# EAGLE schematic ToastSchematic (EAGLE 9.2.1)

## Sheet 1 of 2
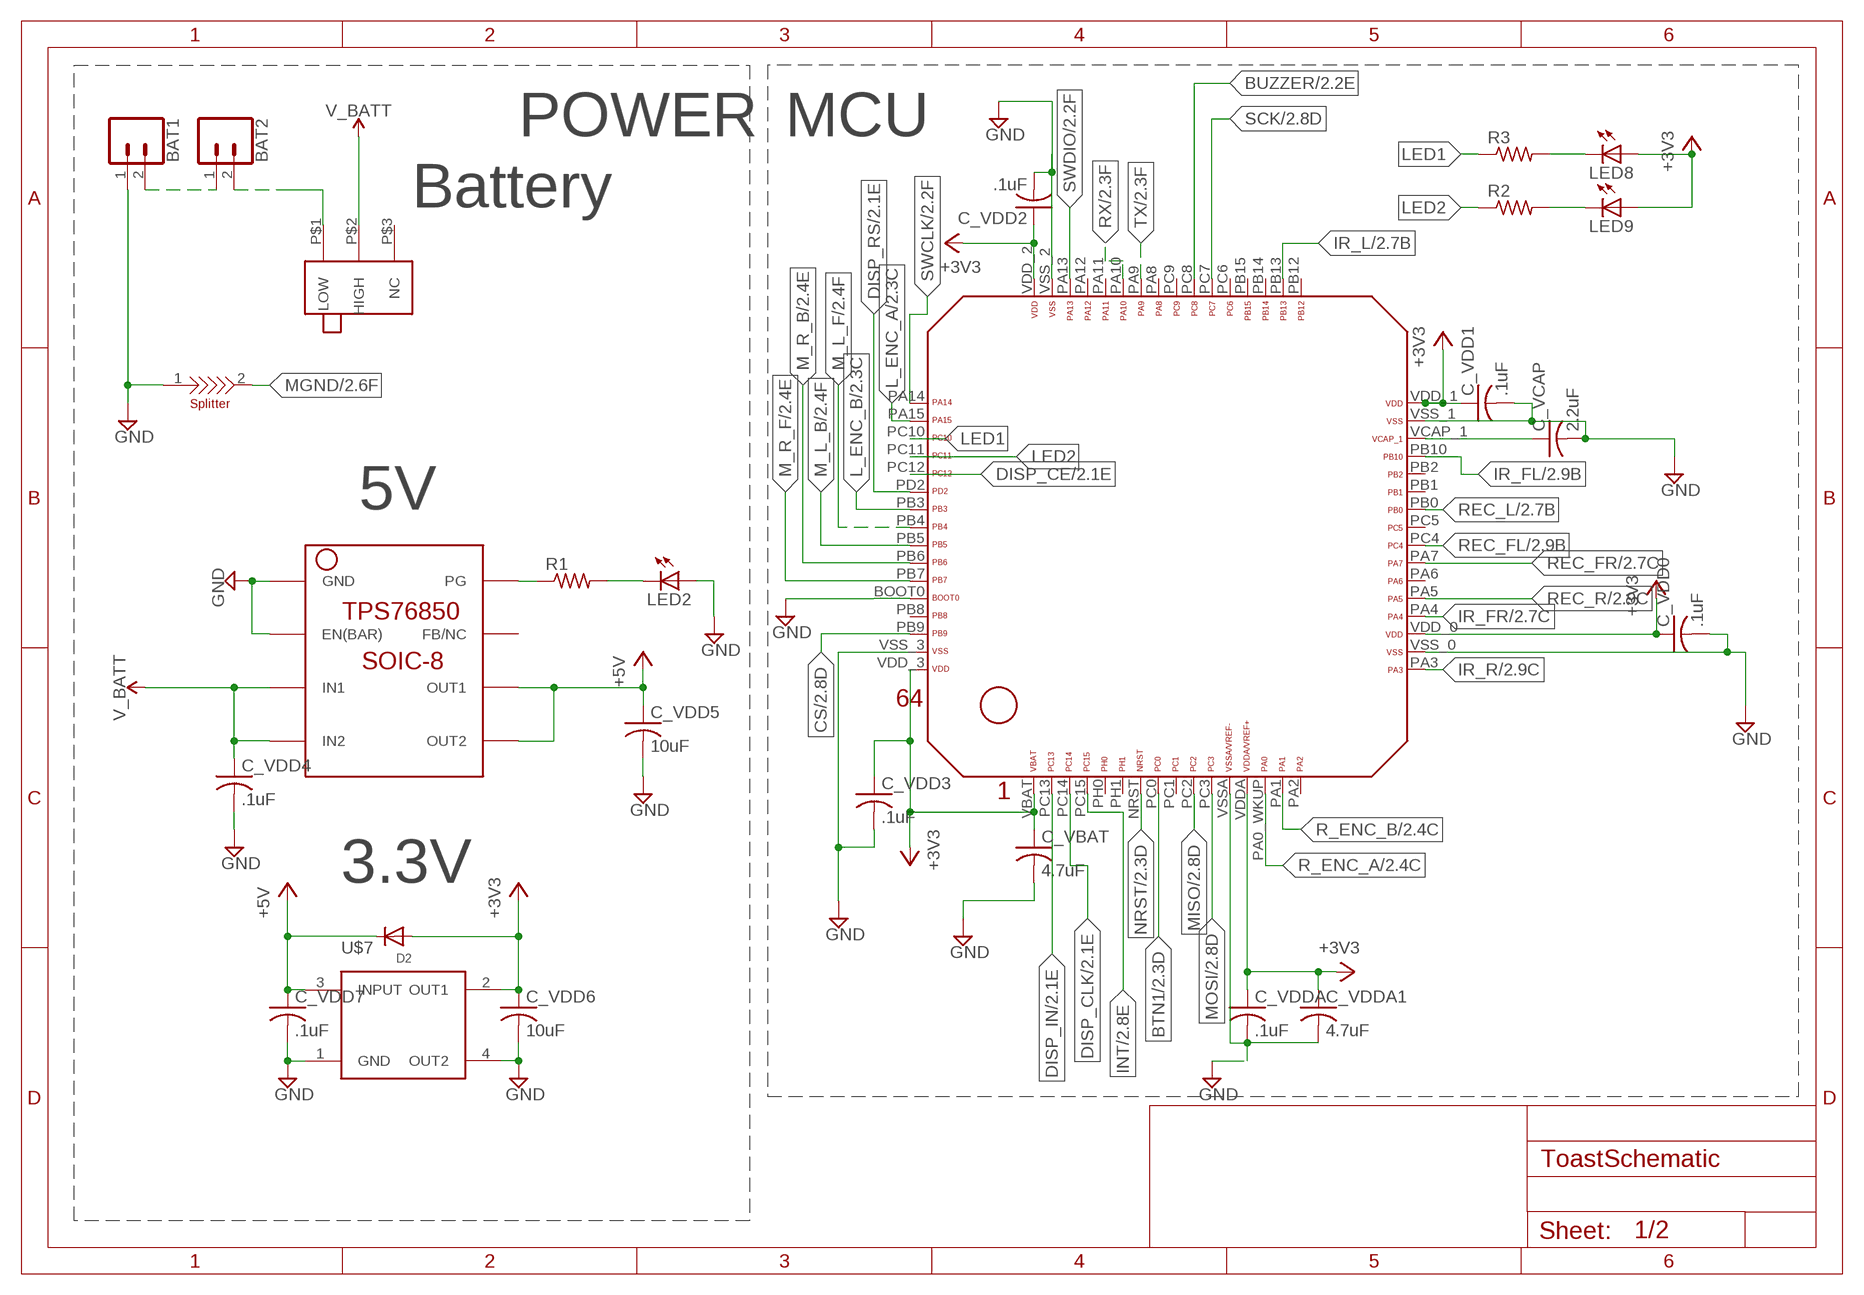
[diagram p0: schematic, sheet 1]

### Parts
BAT1  CONN_02JST-PTH-2  [JST-2-PTH]
BAT2  CONN_02JST-PTH-2  [JST-2-PTH]
C_VBAT  4.7uF  C-USC0603  [C0603]
C_VCAP  2.2uF  C-USC0603  [C0603]
C_VDD0  .1uF  C-USC0603  [C0603]
C_VDD1  .1uF  C-USC0603  [C0603]
C_VDD2  .1uF  C-USC0603  [C0603]
C_VDD3  .1uF  C-USC0603  [C0603]
C_VDD4  .1uF  C-USC0603  [C0603]
C_VDD5  10uF  C-USC0603  [C0603]
C_VDD6  10uF  C-USC0603  [C0603]
C_VDD7  .1uF  C-USC0603  [C0603]
C_VDDA  .1uF  C-USC0603  [C0603]
C_VDDA1  4.7uF  C-USC0603  [C0603]
D2  DIODESOD-323F  [SOD-323F]
LED2  LEDCHIPLED_0603  [CHIPLED_0603]
LED8  LEDCHIPLED_0603  [CHIPLED_0603]
LED9  LEDCHIPLED_0603  [CHIPLED_0603]
R1  R-US_R0603  [R0603]
R2  R-US_R0603  [R0603]
R3  R-US_R0603  [R0603]
U$1  STM32F411/446_LQFP64  [STM32F411/446_LQFP64]
U$2  GH39P0  [GH39P0]
U$3  TPS76850(SOIC-8)  [TPS76850(SOIC-8)]
U$7  TLV1117  [SOT-223]
U$9  SPLITTER  [SPLITTER]

### Nets
+3V3: C_VBAT.1 C_VDD0.1 C_VDD1.1 C_VDD2.1 C_VDD3.1 C_VDD6.1 C_VDDA1.1 C_VDDA.1 D2.A LED8.A LED9.A U$1.VBAT U$1.VDD_0 U$1.VDD_1 U$1.VDD_2 U$1.VDD_3 U$1.VDDA U$7.2(OUT1) ; also sheet 2
+5V: C_VDD5.1 C_VDD7.1 D2.C U$3.OUT1 U$3.OUT2 U$7.3(INPUT) ; also sheet 2
BTN1: U$1.PC0 ; also sheet 2
BUZZER: U$1.PC8 ; also sheet 2
CS: U$1.PB9 ; also sheet 2
DISP_CE: U$1.PC12 ; also sheet 2
DISP_CLK: U$1.PC14 ; also sheet 2
DISP_IN: U$1.PC13 ; also sheet 2
DISP_RS: U$1.PD2 ; also sheet 2
GND: BAT1.1 C_VBAT.2 C_VCAP.2 C_VDD0.2 C_VDD1.2 C_VDD2.2 C_VDD3.2 C_VDD4.2 C_VDD5.2 C_VDD6.2 C_VDD7.2 C_VDDA1.2 C_VDDA.2 LED2.A U$1.BOOT0 U$1.VSS_0 U$1.VSS_1 U$1.VSS_2 U$1.VSS_3 U$1.VSSA U$3.EN(BAR) U$3.GND U$7.1(GND) U$7.4(OUT2) U$9.1 ; also sheet 2
INT: U$1.PC15 ; also sheet 2
IR_FL: U$1.PB10 ; also sheet 2
IR_FR: U$1.PA4 ; also sheet 2
IR_L: U$1.PB13 ; also sheet 2
IR_R: U$1.PA3 ; also sheet 2
L_ENC_A: U$1.PA15 ; also sheet 2
L_ENC_B: U$1.PB3 ; also sheet 2
LED1: R3.1 U$1.PC10
LED2: R2.1 U$1.PC11
M_L_B: U$1.PB5 ; also sheet 2
M_L_F: U$1.PB4 ; also sheet 2
M_R_B: U$1.PB6 ; also sheet 2
M_R_F: U$1.PB7 ; also sheet 2
MGND: U$9.2 ; also sheet 2
MISO: U$1.PC2 ; also sheet 2
MOSI: U$1.PC3 ; also sheet 2
N$1: BAT1.2 BAT2.1
N$2: BAT2.2 U$2.P$1(LOW)
N$5: C_VCAP.1 U$1.VCAP_1
N$6: LED8.C R3.2
N$11: LED2.C R1.2
N$22: R1.1 U$3.PG
N$25: LED9.C R2.2
NRST: U$1.NRST ; also sheet 2
R_ENC_A: U$1.PA0_WKUP(PA0_AKUP) ; also sheet 2
R_ENC_B: U$1.PA1 ; also sheet 2
REC_FL: U$1.PC4 ; also sheet 2
REC_FR: U$1.PA7 ; also sheet 2
REC_L: U$1.PB0 ; also sheet 2
REC_R: U$1.PA5 ; also sheet 2
RX: U$1.PA10 ; also sheet 2
SCK: U$1.PC7 ; also sheet 2
SWCLK: U$1.PA14 ; also sheet 2
SWDIO: U$1.PA13 ; also sheet 2
TX: U$1.PA9 ; also sheet 2
V_BATT: C_VDD4.1 U$2.P$2(HIGH) U$3.IN1 U$3.IN2 ; also sheet 2
Unconnected: U$1.PA2 U$1.PA6 U$1.PA8 U$1.PA11 U$1.PA12 U$1.PB1 U$1.PB2 U$1.PB8 U$1.PB12 U$1.PB14 U$1.PB15 U$1.PC1 U$1.PC5 U$1.PC6 U$1.PC9 U$1.PH0 U$1.PH1 U$2.P$3(NC) U$3.FB/NC

### Notes on the sheet
- POWER | MCU
- Battery
- 5V
- 3.3V

## Sheet 2 of 2
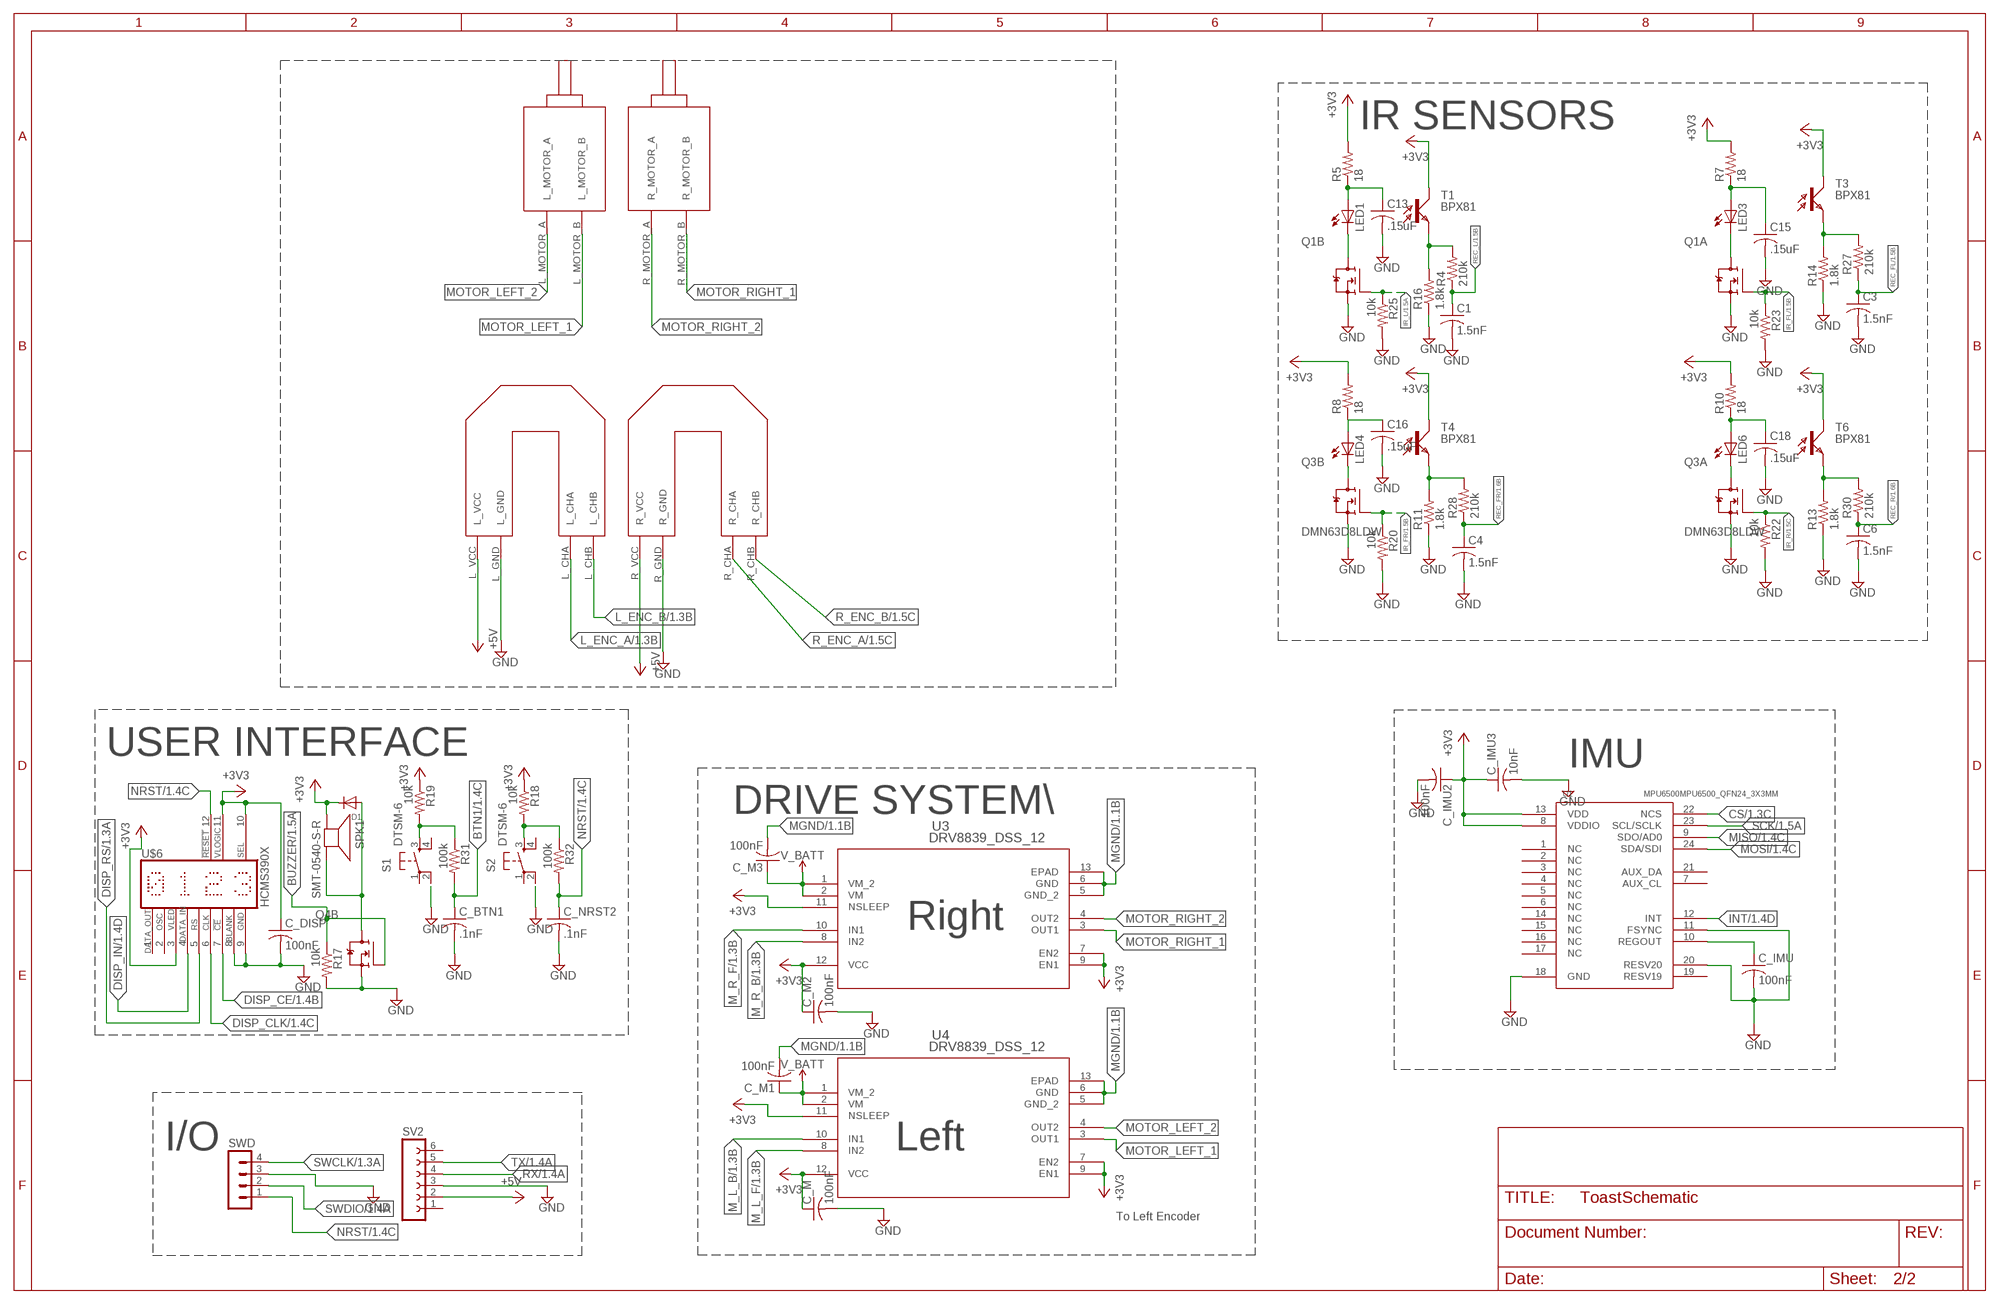
[diagram p1: schematic, sheet 2]

### Parts
C1  1.5nF  C-USC0603K  [C0603K]
C3  1.5nF  C-USC0603K  [C0603K]
C4  1.5nF  C-USC0603K  [C0603K]
C6  1.5nF  C-USC0603K  [C0603K]
C13  .15uF  C-USC0603K  [C0603K]
C15  .15uF  C-USC0603K  [C0603K]
C16  .15uF  C-USC0603K  [C0603K]
C18  .15uF  C-USC0603K  [C0603K]
C_BTN1  .1nF  C-USC0603K  [C0603K]
C_DISP  100nF  C-USC0603K  [C0603K]
C_IMU  100nF  C-USC0603K  [C0603K]
C_IMU2  100nF  C-USC0603K  [C0603K]
C_IMU3  10nF  C-USC0603K  [C0603K]
C_M  100nF  C-USC0603K  [C0603K]
C_M1  100nF  C-USC0603K  [C0603K]
C_M2  100nF  C-USC0603K  [C0603K]
C_M3  100nF  C-USC0603K  [C0603K]
C_NRST2  .1nF  C-USC0603K  [C0603K]
D1  DIODESOD-323F  [SOD-323F]
LED1  LED5MM  [LED5MM]
LED3  LED5MM  [LED5MM]
LED4  LED5MM  [LED5MM]
LED6  LED5MM  [LED5MM]
Q1  DMN63D8LDW  [SOT363]
Q3  DMN63D8LDW  [SOT363]
Q4  DMN63D8LDW  [SOT363]
R4  210k  R-US_R0603  [R0603]
R5  18  R-US_R0603  [R0603]
R7  18  R-US_R0603  [R0603]
R8  18  R-US_R0603  [R0603]
R10  18  R-US_R0603  [R0603]
R11  1.8k  R-US_R0603  [R0603]
R13  1.8k  R-US_R0603  [R0603]
R14  1.8k  R-US_R0603  [R0603]
R16  1.8k  R-US_R0603  [R0603]
R17  10k  R-US_R0603  [R0603]
R18  10k  R-US_R0603  [R0603]
R19  10k  R-US_R0603  [R0603]
R20  10k  R-US_R0603  [R0603]
R22  10k  R-US_R0603  [R0603]
R23  10k  R-US_R0603  [R0603]
R25  10k  R-US_R0603  [R0603]
R27  210k  R-US_R0603  [R0603]
R28  210k  R-US_R0603  [R0603]
R30  210k  R-US_R0603  [R0603]
R31  100k  R-US_R0603  [R0603]
R32  100k  R-US_R0603  [R0603]
S1  DTSM-6  [DTSM-6]
S2  DTSM-6  [DTSM-6]
SPK1  SMT-0540-S-R  [SMT-0540-S-R]
SV2  FE06-1  [FE06]
SWD  MA04-1  [MA04-1]
T1  BPX81  [BPX81]
T3  BPX81  [BPX81]
T4  BPX81  [BPX81]
T6  BPX81  [BPX81]
U1  MPU6500MPU6500_QFN24_3X3MM  [QFN24_3X3MM]
U3  DRV8839_DSS_12  [DSS12_P9X2]
U4  DRV8839_DSS_12  [DSS12_P9X2]
U$4  FUTURA_V1.0_MOTOR_MOUNT  [FUTURA_V1.0_MOTOT_MOUNT]
U$6  HCMS390X  [HCMS390X]

### Nets
+3V3: C_DISP.1 C_IMU2.1 C_IMU3.1 C_M2.1 C_M.1 D1.C R5.2 R7.2 R8.2 R10.2 R18.1 R19.1 SPK1.-(+) T1.C T3.C T4.C T6.C U1.8(VDDIO) U1.13(VDD) U3.7(EN2) U3.9(EN1) U3.11(NSLEEP) U3.12(VCC) U4.7(EN2) U4.9(EN1) U4.11(NSLEEP) U4.12(VCC) U$6.3(VLED) U$6.10(SEL) U$6.11(VLOGIC) ; also sheet 1
+5V: SV2.2 U$4.L_VCC U$4.R_VCC ; also sheet 1
BTN1: C_BTN1.1 R31.2 ; also sheet 1
BUZZER: Q4.5(B:G) R17.1 ; also sheet 1
CS: U1.22(NCS) ; also sheet 1
DISP_CE: U$6.7(!CE) ; also sheet 1
DISP_CLK: U$6.6(CLK) ; also sheet 1
DISP_IN: U$6.4(IN) ; also sheet 1
DISP_RS: U$6.5(RS) ; also sheet 1
GND: C1.2 C3.2 C4.2 C6.2 C13.2 C15.2 C16.2 C18.2 C_BTN1.2 C_DISP.2 C_IMU2.2 C_IMU3.2 C_IMU.2 C_M2.2 C_M.2 C_NRST2.2 Q1.1(A:S) Q1.4(B:S) Q3.1(A:S) Q3.4(B:S) Q4.4(B:S) R11.1 R13.1 R14.1 R16.1 R17.2 R20.2 R22.2 R23.2 R25.2 S1.2 S2.2 SV2.3 SWD.3 U1.11(FSYNC) U1.18(GND) U1.20(RESV20) U$4.L_GND U$4.R_GND U$6.8(BLANK) U$6.9(GND) ; also sheet 1
INT: U1.12(INT) ; also sheet 1
IR_FL: Q1.2(A:G) R23.1 ; also sheet 1
IR_FR: Q3.5(B:G) R20.1 ; also sheet 1
IR_L: Q1.5(B:G) R25.1 ; also sheet 1
IR_R: Q3.2(A:G) R22.1 ; also sheet 1
L_ENC_A: U$4.L_CHA ; also sheet 1
L_ENC_B: U$4.L_CHB ; also sheet 1
M_L_B: U4.10(IN1) ; also sheet 1
M_L_F: U4.8(IN2) ; also sheet 1
M_R_B: U3.8(IN2) ; also sheet 1
M_R_F: U3.10(IN1) ; also sheet 1
MGND: C_M1.2 C_M3.2 U3.5(GND_2) U3.6(GND) U3.13(EPAD) U4.5(GND_2) U4.6(GND) U4.13(EPAD) ; also sheet 1
MISO: U1.9(SDO/AD0) ; also sheet 1
MOSI: U1.24(SDA/SDI) ; also sheet 1
MOTOR_LEFT_1: U4.3(OUT1) U$4.L_MOTOR_B
MOTOR_LEFT_2: U4.4(OUT2) U$4.L_MOTOR_A
MOTOR_RIGHT_1: U3.3(OUT1) U$4.R_MOTOR_B
MOTOR_RIGHT_2: U3.4(OUT2) U$4.R_MOTOR_A
N$8: C13.1 LED1.A R5.1
N$9: LED1.K(C) Q1.3(B:D)
N$10: R19.2 R31.1 S1.3
N$12: LED3.K(C) Q1.6(A:D)
N$13: R18.2 R32.1 S2.3
N$14: C18.1 LED6.A R10.1
N$15: LED6.K(C) Q3.6(A:D)
N$16: C16.1 LED4.A R8.1
N$17: C_IMU.1 U1.10(REGOUT)
N$18: LED4.K(C) Q3.3(B:D)
N$23: D1.A Q4.3(B:D) SPK1.+(-)
N$24: R4.2 R16.2 T1.E
N$27: R14.2 R27.2 T3.E
N$28: R11.2 R28.2 T4.E
N$32: R13.2 R30.2 T6.E
N$33: C15.1 LED3.A R7.1
NRST: C_NRST2.1 R32.2 SWD.1 U$6.12(NOT_RESET) ; also sheet 1
R_ENC_A: U$4.R_CHA ; also sheet 1
R_ENC_B: U$4.R_CHB ; also sheet 1
REC_FL: C3.1 R27.1 ; also sheet 1
REC_FR: C4.1 R28.1 ; also sheet 1
REC_L: C1.1 R4.1 ; also sheet 1
REC_R: C6.1 R30.1 ; also sheet 1
RX: SV2.4 ; also sheet 1
SCK: U1.23(SCL/SCLK) ; also sheet 1
SWCLK: SWD.4 ; also sheet 1
SWDIO: SWD.2 ; also sheet 1
TX: SV2.5 ; also sheet 1
V_BATT: C_M1.1 C_M3.1 U3.1(VM_2) U3.2(VM) U4.1(VM_2) U4.2(VM) ; also sheet 1
Unconnected: Q4.1(A:S) Q4.2(A:G) Q4.6(A:D) S1.1 S1.4 S2.1 S2.4 SV2.1 SV2.6 U1.1(NC) U1.2(NC) U1.3(NC) U1.4(NC) U1.5(NC) U1.6(NC) U1.7(AUX_CL) U1.14(NC) U1.15(NC) U1.16(NC) U1.17(NC) U1.19(RESV19) U1.21(AUX_DA) U$6.1(OUT) U$6.2(OSC)

### Notes on the sheet
- IR SENSORS
- USER INTERFACE | IMU
- DRIVE SYSTEM\
- Right
- I/O | Left
- To Left Encoder

## Library data of the parts
BAT1 BAT2 = SparkFun-Connectors:CONN_02: Multi connection point. Often used as Generic Header-pin footprint for 0.1 inch spaced/style header connections On any of the 0.1 inch spaced packages, you can populate with these: Break Away Headers - Straight <https://www.sparkfun.com/products/116> (PRT-00116) Break Away Male Headers - Right Angle <https://www.sparkfun.com/products/553> (PRT-00553) Female Headers <https://www.sparkfun.com/products/115> (PRT-00115) Break Away Headers - Machine Pin <https://www.sparkfun.com/products/117> (PRT-00117) Break Away Female Headers - Swiss Machine Pin <https://www.sparkfun.com/products/743> (PRT-00743) For SCREWTERMINALS and SPRING TERMINALS visit here: Screw Terimnals on SparkFun.com <https://www.sparkfun.com/search/results?term=Screw+Terminals> (5mm/3.5mm/2.54mm spacing) This device is also useful as a general connection point to wire up your design to another part of your project. Our various solder wires solder well into these plated through hole pads. Hook-Up Wire - Assortment (Stranded, 22 AWG) <https://www.sparkfun.com/products/11375> (PRT-11375) Hook-Up Wire - Assortment (Solid Core, 22 AWG) <https://www.sparkfun.com/products/11367> (PRT-11367) View the entire wire category on our website here <https://www.sparkfun.com/categories/141> Special notes: Molex polarized connector foot print use with: PRT-08233 with associated crimp pins and housings. 2.54_SCREWTERM for use with PRT-10571. 3.5mm Screw Terminal footprints for PRT-08084 5mm Screw Terminal footprints for use with PRT-08432; PROD_ID: CONN-09863; SKU: PRT-09914
C1 C3 C4 C6 C13 C15 C16 C18 C_BTN1 C_DISP C_IMU C_IMU2 C_IMU3 C_M C_M1-C_M3 C_NRST2 C_VBAT C_VCAP C_VDD0 C_VDD1-C_VDD7 C_VDDA C_VDDA1 = rcl:C-US: CAPACITOR, American symbol; SPICEPREFIX: C
D1 D2 = adafruit:DIODE: Diode SMADIODE - SMA Surface Mount Package 20V 1A Schottky Diode Digikey: 641-1014-6-ND DO-1N4148 - Through Hole Small Current Diode SOD-123 20V 1 A (.5mV Vf) Schottky Diode - Digikey: MBRX120TPMSCT-ND SOD-323 10V 570mA (.38mV Vf, 3ns) Schottky Diode - Digikey: ZLLS410CT-ND SOD-523 30V 30mA Schottky Diode (RB751S-40TE61) - Digikey: RB751S-40TE61CT-ND SOT23-R/W - SOT23 Package (R = Solder Paste/Reflow Ovens, W = Hand-Soldering) BAT54Film 40V 300mA - Digikey: 497-7162-1-ND
LED1-LED4 LED6 LED8 LED9 = led:LED: LED OSRAM: - CHIPLED LG R971, LG N971, LY N971, LG Q971, LY Q971, LO R971, LY R971 LH N974, LH R974 LS Q976, LO Q976, LY Q976 LO Q996 - Hyper CHIPLED LW Q18S LB Q993, LB Q99A, LB R99A - SideLED LS A670, LO A670, LY A670, LG A670, LP A670 LB A673, LV A673, LT A673, LW A673 LH A674 LY A675 LS A676, LA A676, LO A676, LY A676, LW A676 LS A679, LY A679, LG A679 - Hyper Micro SIDELED® LS Y876, LA Y876, LO Y876, LY Y876 LT Y87S - SmartLED LW L88C, LW L88S LB L89C, LB L89S, LG L890 LS L89K, LO L89K, LY L89K LS L896, LA L896, LO L896, LY L896 - TOPLED LS T670, LO T670, LY T670, LG T670, LP T670 LSG T670, LSP T670, LSY T670, LOP T670, LYG T670 LG T671, LOG T671, LSG T671 LB T673, LV T673, LT T673, LW T673 LH T674 LS T676, LA T676, LO T676, LY T676, LB T676, LH T676, LSB T676, LW T676 LB T67C, LV T67C, LT T67C, LS T67K, LO T67K, LY T67K, LW E67C LS E67B, LA E67B, LO E67B, LY E67B, LB E67C, LV E67C, LT E67C LW T67C LS T679, LY T679, LG T679 LS T770, LO T770, LY T770, LG T770, LP T770 LB T773, LV T773, LT T773, LW T773 LH T774 LS E675, LA E675, LY E675, LS T675 LS T776, LA T776, LO T776, LY T776, LB T776 LHGB T686 LT T68C, LB T68C - Hyper Mini TOPLED® LB M676 - Mini TOPLED Santana® LG M470 LS M47K, LO M47K, LY M47K Source: http://www.osram.convergy.de LUXEON: - LUMILED® LXK2-PW12-R00, LXK2-PW12-S00, LXK2-PW14-U00, LXK2-PW14-V00 LXK2-PM12-R00, LXK2-PM12-S00, LXK2-PM14-U00 LXK2-PE12-Q00, LXK2-PE12-R00, LXK2-PE12-S00, LXK2-PE14-T00, LXK2-PE14-U00 LXK2-PB12-K00, LXK2-PB12-L00, LXK2-PB12-M00, LXK2-PB14-N00, LXK2-PB14-P00, LXK2-PB14-Q00 LXK2-PR12-L00, LXK2-PR12-M00, LXK2-PR14-Q00, LXK2-PR14-R00 LXK2-PD12-Q00, LXK2-PD12-R00, LXK2-PD12-S00 LXK2-PH12-R00, LXK2-PH12-S00 LXK2-PL12-P00, LXK2-PL12-Q00, LXK2-PL12-R00 Source: www.luxeon.com KINGBRIGHT: KA-3528ASYC Source: www.kingbright.com
Q1 Q3 Q4 = DMN63D8LDW:DMN63D8LDW: Dual N-channel enhancement mode MOSFET
R1 R4 R5 R7 R8 R10 R11 R13 R14 R16-R20 R22 R23 R25 R27 R28 R30-R32 = rcl:R-US_: RESISTOR, American symbol; SPICEPREFIX: R
R2 R3 = resistor:R-US_: RESISTOR, American symbol
S1 S2 = switch-tact:DTSM-6
SPK1 = SMT-0540-S-R:SMT-0540-S-R: SMT-0549-S-R Small surface-mount magnetic buzzer; AVAILABILITY: Good; DESCRIPTION: Audio Indicator Transducer Electromagnetic 3Vp-p 100mA Solder Pad 2Vp-p 3500Hz to 4500Hz Surface Mount; MF: PUI Audio; MP: SMT-0540-S-R; PACKAGE: None; PRICE: 2.43 USD
SV2 = con-lsta:FE06-1: FEMALE HEADER; OC_FARNELL: unknown; OC_NEWARK: unknown
SWD = con-lstb:MA04-1: PIN HEADER; OC_FARNELL: unknown; OC_NEWARK: unknown
T1 T3 T4 T6 = opto-trans-siemens:BPX81: PHOTO TRANSISTOR; OC_FARNELL: unknown; OC_NEWARK: unknown
U1 = Mouse:MPU6500: GYRO/ACCELEROMETER 6AXIS 24QFN; CASE/PACKAGE: QFN; COMPONENTLINK1DESCRIPTION: https://datasheet.ciiva.com/29175/mpu-6500-spec-29175093.pdf; COMPONENTLINK1URL: https://datasheet.ciiva.com/29175/mpu-6500-spec-29175093.pdf; MANUFACTURER: TDK InvenSense; MANUFACTURER_PART_NUMBER: MPU-6500; MAX_OPERATING_TEMPERATURE: 85�C; MIN_OPERATING_TEMPERATURE: -40�C; MOUNT: Surface Mount; NUMBER_OF_PINS: 24; OPERATING_SUPPLY_VOLTAGE: 3.45V; OUTPUT_TYPE: Digital; PACKAGE_QUANTITY: 5000; SENSOR_TYPE: Accelerometer,Gyroscope; STOCK_1: 0; SUPPLIER_1: Mouser; SUPPLIER_PART_NUMBER_1: 410-MPU-6500
U3 U4 = DRV8839:DRV8839_DSS_12; MANUFACTURER_PART_NUMBER: drv8839_dss_12; VENDOR: Texas Instruments
U$1 = STM32F10x F4xx:STM32F411/446_LQFP64
U$2 = Mouse:GH39P0
U$3 = TPS76850SOIC-8:TPS76850(SOIC-8)
U$4 = Futura 1.0 motor mount template:FUTURA_V1.0_MOTOR_MOUNT
U$6 = display-hp:HCMS390X
U$7 = Mouse:TLV1117
U$9 = splitter:SPLITTER